# EAGLE design cpu (EAGLE 4.16)
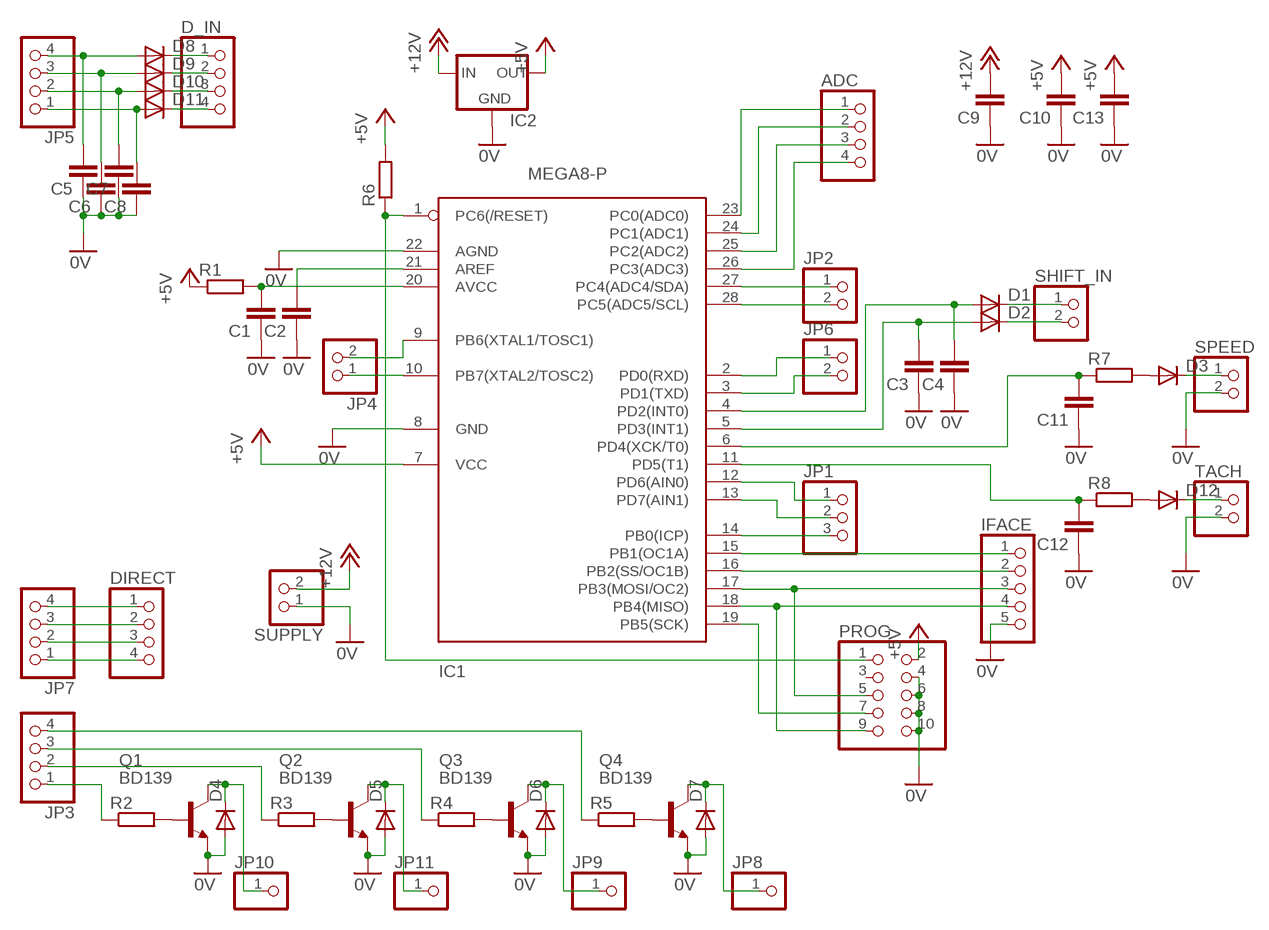
[diagram p0: schematic, sheet 1]

## Parts
ADC  PINHD-1X4  [1X04]
C1  C-EU050-025X075  [C050-025X075]
C2  C-EU050-025X075  [C050-025X075]
C3  C-EU050-025X075  [C050-025X075]
C4  C-EU050-025X075  [C050-025X075]
C5  C-EU050-025X075  [C050-025X075]
C6  C-EU050-025X075  [C050-025X075]
C7  C-EU050-025X075  [C050-025X075]
C8  C-EU050-025X075  [C050-025X075]
C9  C-EU050-025X075  [C050-025X075]
C10  C-EU050-025X075  [C050-025X075]
C11  C-EU050-025X075  [C050-025X075]
C12  C-EU050-025X075  [C050-025X075]
C13  C-EU050-025X075  [C050-025X075]
D1  DIODE-D-5  [D-5]
D2  DIODE-D-5  [D-5]
D3  DIODE-D-5  [D-5]
D4  DIODE-D-5  [D-5]
D5  DIODE-D-5  [D-5]
D6  DIODE-D-5  [D-5]
D7  DIODE-D-5  [D-5]
D8  DIODE-D-5  [D-5]
D9  DIODE-D-5  [D-5]
D10  DIODE-D-5  [D-5]
D11  DIODE-D-5  [D-5]
D12  DIODE-D-5  [D-5]
D_IN  PINHD-1X4  [1X04]
DIRECT  PINHD-1X4  [1X04]
IC1  MEGA8-P  [DIL28-3]
IC2  78XXL  [78XXL]
IFACE  PINHD-1X5  [1X05]
JP1  PINHD-1X3  [1X03]
JP2  PINHD-1X2  [1X02]
JP3  PINHD-1X4  [1X04]
JP4  PINHD-1X2  [1X02]
JP5  PINHD-1X4  [1X04]
JP6  PINHD-1X2  [1X02]
JP7  PINHD-1X4  [1X04]
JP8  PINHD-1X1  [1X01]
JP9  PINHD-1X1  [1X01]
JP10  PINHD-1X1  [1X01]
JP11  PINHD-1X1  [1X01]
PROG  PINHD-2X5  [2X05]
Q1  BD139  [TO126]
Q2  BD139  [TO126]
Q3  BD139  [TO126]
Q4  BD139  [TO126]
R1  R-EU_0207/7  [0207/7]
R2  R-EU_0207/7  [0207/7]
R3  R-EU_0207/7  [0207/7]
R4  R-EU_0207/7  [0207/7]
R5  R-EU_0207/7  [0207/7]
R6  R-EU_0207/7  [0207/7]
R7  R-EU_0207/7  [0207/7]
R8  R-EU_0207/7  [0207/7]
SHIFT_IN  PINHD-1X2  [1X02]
SPEED  PINHD-1X2  [1X02]
SUPPLY  PINHD-1X2  [1X02]
TACH  PINHD-1X2  [1X02]

## Nets
0V: C1.1 C2.1 C3.1 C4.1 C5.1 C6.1 C7.1 C8.1 C9.1 C10.1 C11.1 C12.1 C13.1 D4.A D5.A D6.A D7.A IC1.8(GND) IC1.22(AGND) IC2.GND IFACE.5 PROG.4 PROG.6 PROG.8 PROG.10 Q1.1(E) Q2.1(E) Q3.1(E) Q4.1(E) SPEED.2 SUPPLY.1 TACH.2
+5V: C10.2 C13.2 IC1.7(VCC) IC2.OUT PROG.2 R1.1 R6.2
+12V: C9.2 IC2.IN SUPPLY.2
N$1: D7.C JP8.1 Q4.2(C)
N$2: IC1.17(PB3(MOSI/OC2)) IFACE.3 PROG.5
N$3: IC1.18(PB4(MISO)) IFACE.4 PROG.9
N$4: IC1.19(PB5(SCK)) PROG.7
N$5: IC1.1(PC6(/RESET)) PROG.1 R6.1
N$6: C4.2 D1.A IC1.4(PD2(INT0))
N$7: C3.2 D2.A IC1.5(PD3(INT1))
N$8: C1.2 IC1.20(AVCC) R1.2
N$9: C2.2 IC1.21(AREF)
N$10: C12.2 IC1.11(PD5(T1)) R8.1
N$11: C11.2 IC1.6(PD4(XCK/T0)) R7.1
N$12: Q1.3(B) R2.2
N$13: Q2.3(B) R3.2
N$14: D4.C JP10.1 Q1.2(C)
N$15: D5.C JP11.1 Q2.2(C)
N$16: JP3.1 R2.1
N$17: Q3.3(B) R4.2
N$18: D6.C JP9.1 Q3.2(C)
N$19: JP3.2 R3.1
N$20: Q4.3(B) R5.2
N$21: JP3.3 R4.1
N$22: JP3.4 R5.1
N$23: D1.C SHIFT_IN.1
N$24: D2.C SHIFT_IN.2
N$25: ADC.1 IC1.23(PC0(ADC0))
N$26: ADC.2 IC1.24(PC1(ADC1))
N$27: ADC.3 IC1.25(PC2(ADC2))
N$28: ADC.4 IC1.26(PC3(ADC3))
N$29: IC1.27(PC4(ADC4/SDA)) JP2.1
N$30: IC1.28(PC5(ADC5/SCL)) JP2.2
N$31: IC1.13(PD7(AIN1)) JP1.2
N$32: IC1.12(PD6(AIN0)) JP1.1
N$33: IC1.15(PB1(OC1A)) IFACE.1
N$34: IC1.16(PB2(SS/OC1B)) IFACE.2
N$35: D8.C D_IN.1
N$36: D9.C D_IN.2
N$37: D10.C D_IN.3
N$38: D11.C D_IN.4
N$39: C5.2 D8.A JP5.4
N$40: C6.2 D9.A JP5.3
N$41: C7.2 D10.A JP5.2
N$42: C8.2 D11.A JP5.1
N$43: IC1.14(PB0(ICP)) JP1.3
N$44: IC1.2(PD0(RXD)) JP6.1
N$45: IC1.3(PD1(TXD)) JP6.2
N$46: IC1.10(PB7(XTAL2/TOSC2)) JP4.1
N$47: IC1.9(PB6(XTAL1/TOSC1)) JP4.2
N$48: DIRECT.4 JP7.1
N$49: DIRECT.3 JP7.2
N$50: DIRECT.2 JP7.3
N$51: DIRECT.1 JP7.4
N$52: D3.C SPEED.1
N$54: D12.C TACH.1
N$82: D3.A R7.2
N$83: D12.A R8.2
Unconnected: PROG.3

## Library data of the parts
ADC D_IN DIRECT JP3 JP5 JP7 = pinhead:PINHD-1X4: PIN HEADER
C1-C13 = rcl:C-EU: CAPACITOR, European symbol
D1-D12 = diode:DIODE-: DIODE
IC1 = atmel:MEGA8-P: MICROCONTROLLER 8 Kbytes FLASH 1 kbytes SRAM 512 bytes EEPROM USART 4-channel 10 bit ADC 2-channel 8 bit ADC Source: avr.lbr
IC2 = v-reg:78XXL: VOLTAGE REGULATOR
IFACE = pinhead:PINHD-1X5: PIN HEADER
JP1 = pinhead:PINHD-1X3: PIN HEADER
JP2 JP4 JP6 SHIFT_IN SPEED SUPPLY TACH = pinhead:PINHD-1X2: PIN HEADER
JP8-JP11 = pinhead:PINHD-1X1: PIN HEADER
PROG = pinhead:PINHD-2X5: PIN HEADER
Q1-Q4 = transistor-npn:BD139*: NPN Transistor
R1-R8 = rcl:R-EU_: RESISTOR, European symbol

## Board
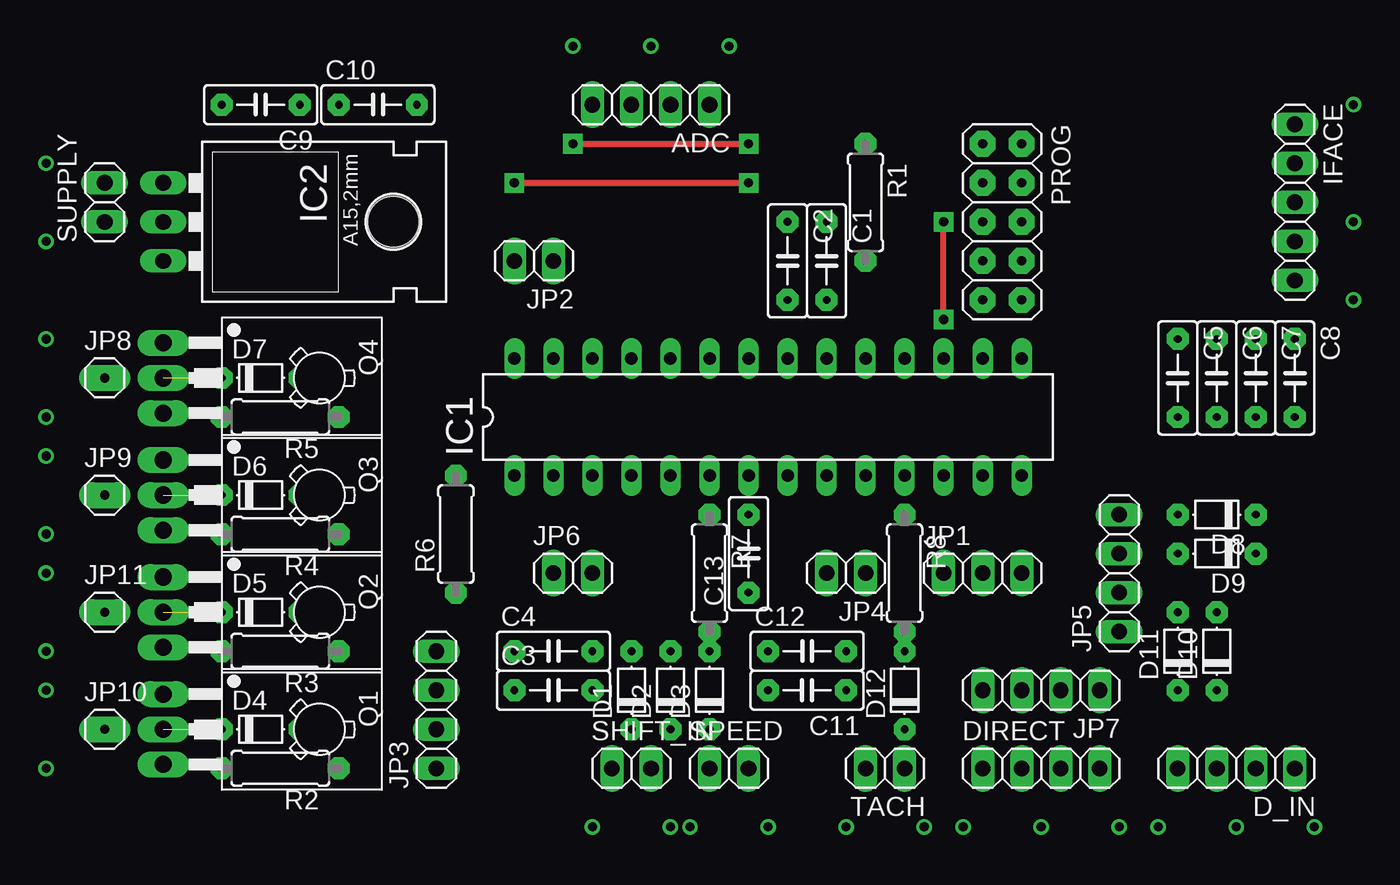
[diagram p1: board, top side]
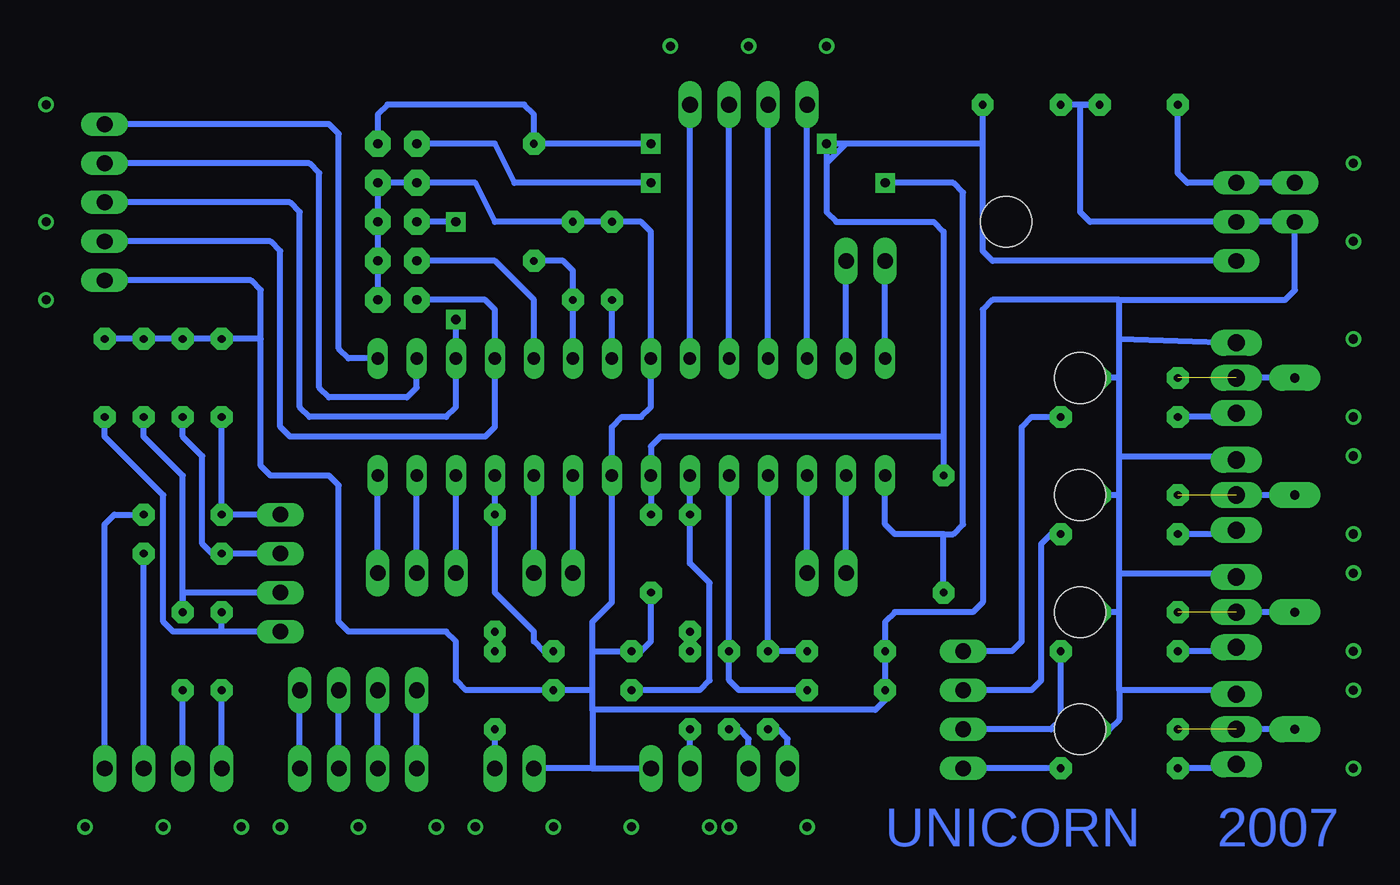
[diagram p2: board, bottom side, seen from below]

No outline drawn. Coordinates in mm, seen from the top.
Copper layers (1*16): Top 0.035mm / dielectric 1.5mm / Bottom 0.035mm
Design rules "default": minimum track width 10mil, minimum drill 24mil, track to track 8mil, track to pad 8mil, pad to pad 8mil, via to via 8mil, smd to smd 8mil, copper to edge 40mil, drill to drill 8mil, minimum pad ring 10mil, minimum via ring 8mil, stop-mask expansion 4mil, vias tented up to drill 0mil, thermal gap 10mil

### Footprints (pad centres in the part's own frame; a part is rotated, then mirrored left to right if it is on the bottom)
1X04 = drill 1.016 long: 1 -3.81,0; 2 -1.27,0; 3 1.27,0; 4 3.81,0
C050-025X075 = drill 0.5 pad 1.422 octagon: 1 -2.54,0; 2 2.54,0
D-5 = drill 0.5 pad 1.422 octagon: A 2.54,0; C -2.54,0
DIL28-3 = drill 0.813 long: 1 -16.51,-3.81; 2 -13.97,-3.81; 3 -11.43,-3.81; 4 -8.89,-3.81; 5 -6.35,-3.81; 6 -3.81,-3.81; 7 -1.27,-3.81; 8 1.27,-3.81; 9 3.81,-3.81; 10 6.35,-3.81; 11 8.89,-3.81; 12 11.43,-3.81; 13 13.97,-3.81; 14 16.51,-3.81; 15 16.51,3.81; 16 13.97,3.81; 17 11.43,3.81; 18 8.89,3.81; 19 6.35,3.81; 20 3.81,3.81; 21 1.27,3.81; 22 -1.27,3.81; 23 -3.81,3.81; 24 -6.35,3.81; 25 -8.89,3.81; 26 -11.43,3.81; 27 -13.97,3.81; 28 -16.51,3.81
78XXL = drill 1.016 long: GND 0,-3.81; IN -2.54,-3.81; OUT 2.54,-3.81 | hole 3.302: 0,11.176
1X05 = drill 1.016 long: 1 -5.08,0; 2 -2.54,0; 3 0,0; 4 2.54,0; 5 5.08,0
1X03 = drill 1.016 long: 1 -2.54,0; 2 0,0; 3 2.54,0
1X02 = drill 1.016 long: 1 -1.27,0; 2 1.27,0
1X01 = drill 0.6 pad 1.676 long: 1 0,0
2X05 = drill 0.6 pad 1.676 octagon: 1 -5.08,-1.27; 2 -5.08,1.27; 3 -2.54,-1.27; 4 -2.54,1.27; 5 0,-1.27; 6 0,1.27; 7 2.54,-1.27; 8 2.54,1.27; 9 5.08,-1.27; 10 5.08,1.27
TO126 = drill 1.118 long: 1 -2.286,-5.08; 2 0,-5.08; 3 2.286,-5.08 | hole 3.302: 0,5.08
0207/7 = drill 0.5 pad 1.422 octagon: 1 -3.81,0; 2 3.81,0

### Placement (x,y rotation side)
ADC  45.72,57.15 180 top
C1  57.15,46.99 270 top
C2  54.61,46.99 270 top
C3  39.37,19.05 0 top
C4  39.37,21.59 0 top
C5  80.01,39.37 270 top
C6  82.55,39.37 270 top
C7  85.09,39.37 270 top
C8  87.63,39.37 270 top
C9  20.32,57.15 180 top
C10  27.94,57.15 0 top
C11  55.88,19.05 180 top
C12  55.88,21.59 0 top
C13  52.07,27.94 90 top
D1  44.45,19.05 90 top
D2  46.99,19.05 90 top
D3  49.53,19.05 90 top
D4  20.32,16.51 0 top
D5  20.32,24.13 0 top
D6  20.32,31.75 0 top
D7  20.32,39.37 0 top
D8  82.55,30.48 180 top
D9  82.55,27.94 180 top
D10  82.55,21.59 90 top
D11  80.01,21.59 90 top
D12  62.23,19.05 90 top
D_IN  83.82,13.97 180 top
DIRECT  71.12,13.97 0 top
IC1  53.34,36.83 0 top
IC2  17.78,49.53 270 top
IFACE  87.63,50.8 270 top
JP1  67.31,26.67 0 top
JP2  38.1,46.99 180 top
JP3  31.75,17.78 90 top
JP4  58.42,26.67 180 top
JP5  76.2,26.67 90 top
JP6  40.64,26.67 0 top
JP7  71.12,19.05 180 top
JP8  10.16,39.37 0 top
JP9  10.16,31.75 0 top
JP10  10.16,16.51 0 top
JP11  10.16,24.13 0 top
PROG  68.58,49.53 270 top
Q1  19.05,16.51 270 top
Q2  19.05,24.13 270 top
Q3  19.05,31.75 270 top
Q4  19.05,39.37 270 top
R1  59.69,50.8 270 top
R2  21.59,13.97 180 top
R3  21.59,21.59 180 top
R4  21.59,29.21 180 top
R5  21.59,36.83 180 top
R6  33.02,29.21 90 top
R7  49.53,26.67 270 top
R8  62.23,26.67 270 top
SHIFT_IN  44.45,13.97 0 top
SPEED  50.8,13.97 0 top
SUPPLY  10.16,50.8 90 top
TACH  60.96,13.97 180 top

### Tracks (layer width: path | path; a pad name or v marks a point on that pad's centre or on a via)
0V
  Bottom 0.406: PROG.8 PROG.6 PROG.4 | PROG.8 PROG.10 | 55.88,17.78 55.88,19.05 | 55.88,19.05 55.88,21.59 | 55.88,21.59 55.88,23.5 54.61,24.77 IC1.8 54.61,36.2 53.98,36.83 52.7,36.83 52.07,37.47 IC1.22 52.07,48.9 52.7,49.53 C2.1 C1.1 62.23,49.53 63.5,52.07 PROG.4 | 55.88,13.97 SPEED.2 | 55.88,13.97 TACH.2 | 55.88,21.59 C12.1 52.7,21.59 52.07,22.23 C13.1 | 55.88,19.05 C11.1 64.14,19.05 64.77,19.68 64.77,22.23 65.41,22.86 71.75,22.86 72.39,23.5 72.39,32.38 73.03,33.02 76.83,33.02 77.47,33.66 77.47,41.91 | 21.59,41.91 Q4.1 | 21.59,39.37 21.59,41.91 | 21.59,34.29 21.59,39.37 | Q3.1 13.97,34.29 21.59,34.29 | 21.59,31.75 21.59,34.29 | 21.59,26.67 21.59,31.75 | Q2.1 13.97,26.67 21.59,26.67 | Q1.1 13.97,19.05 21.59,19.05 | 21.59,24.13 21.59,26.67 | 21.59,19.05 21.59,24.13 | 21.59,39.37 D7.A | 21.59,31.75 D6.A | 21.59,24.13 D5.A | 21.59,19.05 21.59,17.14 22.23,16.51 D4.A | C4.1 C3.1 | SUPPLY.1 IC2.GND | SUPPLY.1 IC2.GND | 21.59,44.45 10.79,44.45 10.16,45.09 SUPPLY.1 | 21.59,41.91 21.59,44.45 | IC2.GND 23.5,49.53 24.13,50.16 24.13,57.15 C9.1 C10.1 | C4.1 36.83,23.5 36.2,24.13 31.11,24.13 30.48,24.77 30.48,43.81 29.84,44.45 21.59,44.45 | C8.1 C7.1 C6.1 C5.1 77.47,41.91 | 77.47,41.91 77.47,45.09 78.11,45.72 IFACE.5 | PROG.4 PROG.8 | C4.1 36.83,18.41 37.47,17.78 55.88,17.78 | 55.88,17.78 55.88,13.97
+5V  (via drill 0.6 pad 1.27)
  Top 0.406: v40.64,54.61 v52.07,54.61
  Bottom 0.406: 33.02,35.56 51.44,35.56 52.07,34.92 IC1.7 C13.2 | PROG.2 69.85,56.52 69.22,57.15 60.33,57.15 59.69,56.52 R1.1 v52.07,54.61 | 40.64,53.34 v40.64,54.61 39.37,54.61 | 40.64,53.34 40.64,50.16 40.01,49.53 33.66,49.53 33.02,48.9 33.02,35.56 | 33.02,35.56 R6.2 | IC2.OUT 29.84,46.99 30.48,47.62 30.48,54.61 | 30.48,54.61 39.37,54.61 | 30.48,54.61 C10.2 | 39.37,54.61 40.64,53.34
+12V
  Bottom 0.406: SUPPLY.2 IC2.IN 17.14,52.07 17.78,52.7 C9.2
N$1  (1 unrouted)
  Bottom 0.406: JP8.1 Q4.2
N$2  (via drill 0.6 pad 1.27)
  Top 0.406: v64.77,43.18 v64.77,49.53
  Bottom 0.406: IFACE.3 75.56,50.8 74.93,50.16 74.93,37.47 74.3,36.83 65.41,36.83 64.77,37.47 IC1.17 v64.77,43.18 | v64.77,49.53 PROG.5
N$3
  Bottom 0.406: IFACE.4 76.83,48.26 76.2,47.62 76.2,36.2 75.56,35.56 62.87,35.56 62.23,36.2 IC1.18 62.23,43.81 62.87,44.45 PROG.9
N$4
  Bottom 0.406: IC1.19 59.69,44.45 62.23,46.99 PROG.7
N$5  (via drill 0.6 pad 1.27)
  Top 0.406: v36.83,52.07 v52.07,52.07
  Bottom 0.406: PROG.1 62.23,54.61 60.96,52.07 v52.07,52.07 | R6.1 33.02,29.21 | 33.02,29.21 36.2,29.21 36.83,29.84 IC1.1 | 33.02,29.21 32.38,29.21 31.75,29.84 31.75,51.44 32.38,52.07 v36.83,52.07
N$6
  Bottom 0.406: IC1.4 D1.A C4.2
N$7
  Bottom 0.406: IC1.5 D2.A 46.99,19.68 46.35,19.05 C3.2
N$8
  Bottom 0.406: IC1.20 C1.2 57.15,46.35 57.78,46.99 R1.2
N$9
  Bottom 0.406: IC1.21 C2.2
N$10
  Bottom 0.406: C12.2 59.05,21.59 59.69,22.23 59.69,22.86 62.23,25.4 R8.1 IC1.11
N$11
  Bottom 0.406: C11.2 48.9,19.05 48.26,19.68 48.26,26.04 48.9,26.67 49.53,27.3 R7.1 IC1.6
N$12
  Bottom 0.406: Q1.3 13.97,13.97 R2.2
N$13
  Bottom 0.406: Q2.3 13.97,21.59 R3.2
N$14  (1 unrouted)
  Bottom 0.406: JP10.1 Q1.2
N$15  (1 unrouted)
  Bottom 0.406: JP11.1 Q2.2
N$16
  Bottom 0.406: R2.1 JP3.1
N$17
  Bottom 0.406: Q3.3 13.97,29.21 R4.2
N$18  (1 unrouted)
  Bottom 0.406: JP9.1 Q3.2
N$19
  Bottom 0.406: R3.1 25.4,17.14 26.04,16.51 JP3.2
N$20
  Bottom 0.406: Q4.3 13.97,36.83 R5.2
N$21
  Bottom 0.406: R4.1 26.04,29.21 26.67,28.57 26.67,19.68 27.3,19.05 JP3.3
N$22
  Bottom 0.406: R5.1 27.3,36.83 27.94,36.2 27.94,22.23 28.57,21.59 JP3.4
N$23
  Bottom 0.406: SHIFT_IN.1 43.18,15.88 43.81,16.51 D1.C
N$24
  Bottom 0.406: SHIFT_IN.2 45.72,15.88 46.35,16.51 D2.C
N$25
  Bottom 0.406: IC1.23 ADC.1
N$26
  Bottom 0.406: IC1.24 ADC.2
N$27
  Bottom 0.406: IC1.25 ADC.3
N$28
  Bottom 0.406: IC1.26 ADC.4
N$29
  Bottom 0.406: IC1.27 JP2.1
N$30
  Bottom 0.406: IC1.28 JP2.2
N$31
  Bottom 0.406: JP1.2 IC1.13
N$32
  Bottom 0.406: JP1.1 IC1.12
N$33
  Bottom 0.406: IC1.15 71.75,40.64 72.39,41.27 72.39,55.24 73.03,55.88 IFACE.1
N$34
  Bottom 0.406: IC1.16 67.31,38.73 67.94,38.1 73.03,38.1 73.66,38.73 73.66,52.7 74.3,53.34 IFACE.2
N$35
  Bottom 0.406: D_IN.1 87.63,29.84 87,30.48 D8.C
N$36
  Bottom 0.406: D_IN.2 D9.C
N$37
  Bottom 0.406: D_IN.3 D10.C
N$38
  Bottom 0.406: D_IN.4 D11.C
N$39
  Bottom 0.406: JP5.4 D8.A C5.2
N$40
  Bottom 0.406: JP5.3 D9.A 80.64,27.94 81.28,28.57 81.28,34.29 82.55,35.56 C6.2
N$41
  Bottom 0.406: JP5.2 82.55,25.4 D10.A 82.55,33.02 85.09,35.56 C7.2
N$42
  Bottom 0.406: JP5.1 80.01,22.86 | 80.01,22.86 D11.A | 80.01,22.86 83.19,22.86 83.82,23.5 83.82,31.75 87.63,35.56 C8.2
N$43
  Bottom 0.406: JP1.3 IC1.14
N$44
  Bottom 0.406: JP6.1 IC1.2
N$45
  Bottom 0.406: JP6.2 IC1.3
N$46
  Bottom 0.406: JP4.1 IC1.10
N$47
  Bottom 0.406: JP4.2 IC1.9
N$48
  Bottom 0.406: DIRECT.4 JP7.1
N$49
  Bottom 0.406: DIRECT.3 JP7.2
N$50
  Bottom 0.406: DIRECT.2 JP7.3
N$51
  Bottom 0.406: DIRECT.1 JP7.4
N$52
  Bottom 0.406: SPEED.1 D3.C
N$53  (via drill 0.6)
  other vias: 6.35,41.91
N$54
  Bottom 0.406: TACH.1 D12.C
N$55  (via drill 0.6)
  other vias: 6.35,36.83
N$56  (via drill 0.6)
  other vias: 6.35,34.29
N$57  (via drill 0.6)
  other vias: 6.35,29.21
N$58  (via drill 0.6)
  other vias: 6.35,26.67
N$59  (via drill 0.6)
  other vias: 6.35,21.59
N$60  (via drill 0.6)
  other vias: 6.35,19.05
N$61  (via drill 0.6)
  other vias: 6.35,13.97
N$62  (via drill 0.6)
  other vias: 40.64,60.96
N$63  (via drill 0.6)
  other vias: 45.72,60.96
N$64  (via drill 0.6)
  other vias: 50.8,60.96
N$65  (via drill 0.6)
  other vias: 46.99,10.16
N$66  (via drill 0.6)
  other vias: 41.91,10.16
N$67  (via drill 0.6)
  other vias: 53.34,10.16
N$68  (via drill 0.6)
  other vias: 48.26,10.16
N$69  (via drill 0.6)
  other vias: 66.04,10.16
N$70  (via drill 0.6)
  other vias: 76.2,10.16
N$71  (via drill 0.6)
  other vias: 71.12,10.16
N$72  (via drill 0.6)
  other vias: 83.82,10.16
N$73  (via drill 0.6)
  other vias: 78.74,10.16
N$74  (via drill 0.6)
  other vias: 88.9,10.16
N$75  (via drill 0.6)
  other vias: 6.35,53.34
N$76  (via drill 0.6)
  other vias: 6.35,48.26
N$77  (via drill 0.6)
  other vias: 58.42,10.16
N$78  (via drill 0.6)
  other vias: 63.5,10.16
N$79  (via drill 0.6)
  other vias: 91.44,49.53
N$80  (via drill 0.6)
  other vias: 91.44,44.45
N$81  (via drill 0.6)
  other vias: 91.44,57.15
N$82
  Bottom 0.406: D3.A R7.2
N$83
  Bottom 0.406: D12.A R8.2

### Text on the board
Bottom: 2007 | UNICORN